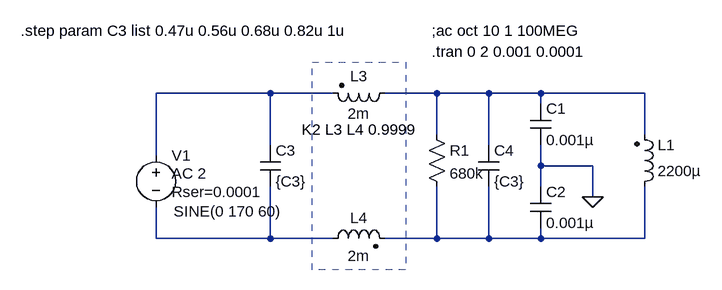
[diagram p0: schematic Draft1.asc]
Draft1.asc, the LTspice schematic file:
Version 4
SHEET 1 880 680
WIRE -464 64 -640 64
WIRE -368 64 -464 64
WIRE -208 64 -288 64
WIRE -128 64 -208 64
WIRE -48 64 -128 64
WIRE 112 64 -48 64
WIRE -48 80 -48 64
WIRE -208 128 -208 64
WIRE 112 128 112 64
WIRE -464 144 -464 64
WIRE -128 144 -128 64
WIRE -640 160 -640 64
WIRE -48 176 -48 144
WIRE 32 176 -48 176
WIRE -48 208 -48 176
WIRE 32 224 32 176
WIRE -640 288 -640 240
WIRE -464 288 -464 208
WIRE -464 288 -640 288
WIRE -368 288 -464 288
WIRE -208 288 -208 208
WIRE -208 288 -288 288
WIRE -128 288 -128 208
WIRE -128 288 -208 288
WIRE -48 288 -48 272
WIRE -48 288 -128 288
WIRE 112 288 112 208
WIRE 112 288 -48 288
FLAG 32 224 0
SYMBOL ind2 96 224 M180
WINDOW 0 36 80 Left 2
WINDOW 3 36 40 Left 2
SYMATTR InstName L1
SYMATTR Value 2200µ
SYMATTR Type ind
SYMATTR SpiceLine Rser=120
SYMBOL voltage -640 144 R0
WINDOW 3 27 102 Left 2
WINDOW 123 24 44 Left 2
WINDOW 39 24 72 Left 2
SYMATTR Value SINE(0 170 60)
SYMATTR Value2 AC 2
SYMATTR SpiceLine Rser=0.0001
SYMATTR InstName V1
SYMBOL cap -64 80 R0
SYMATTR InstName C1
SYMATTR Value 0.001µ
SYMBOL cap -64 208 R0
SYMATTR InstName C2
SYMATTR Value 0.001µ
SYMBOL ind2 -272 48 R90
WINDOW 0 5 56 VBottom 2
WINDOW 3 32 56 VTop 2
SYMATTR InstName L3
SYMATTR Value 2m
SYMATTR SpiceLine Rser=22m
SYMATTR Type ind
SYMBOL ind2 -384 304 R270
WINDOW 0 32 56 VTop 2
WINDOW 3 5 56 VBottom 2
SYMATTR InstName L4
SYMATTR Value 2m
SYMATTR Type ind
SYMATTR SpiceLine Rser=22m
SYMBOL cap -144 144 R0
SYMATTR InstName C4
SYMATTR Value {C3}
SYMBOL res -224 112 R0
SYMATTR InstName R1
SYMATTR Value 680k
SYMBOL cap -480 144 R0
SYMATTR InstName C3
SYMATTR Value {C3}
TEXT -216 -32 Left 2 !;ac oct 10 1 100MEG
TEXT -216 0 Left 2 !.tran 0 2 0.001 0.0001
TEXT -416 120 Left 2 !K2 L3 L4 0.9999
TEXT -848 -32 Left 2 !.step param C3 list 0.47u 0.56u 0.68u 0.82u 1u
RECTANGLE Normal -256 336 -400 16 2

The netlist it stands for:
* Draft1.asc
L1 N004 N002 2200µ Rser=120
V1 N001 N003 SINE(0 170 60) AC 2 Rser=0.0001
C1 N002 0 0.001µ
C2 0 N004 0.001µ
L3 N002 N001 2m Rser=22m
L4 N003 N004 2m Rser=22m
C4 N002 N004 {C3}
R1 N002 N004 680k
C3 N001 N003 {C3}
;ac oct 10 1 100MEG
.tran 0 2 0.001 0.0001
K2 L3 L4 0.9999
.step param C3 list 0.47u 0.56u 0.68u 0.82u 1u
.backanno
.end